# EAGLE design placaSinalizadores (EAGLE 9.6.2)
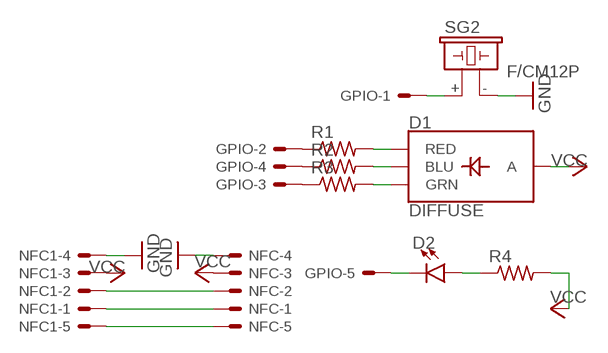
[diagram p0: schematic, sheet 1]

## Parts
D1  DIFFUSE  LED-RGB-CADIFFUSE  [LED-RGB-THRU]
D2  LED5MM  [LED_5MM]
GPIO  JST-XH-05-PIN-LONG-PAD  [JST-XH-05-PACKAGE-LONG-PAD]
NFC  JST-XH-05-PIN-LONG-PAD  [JST-XH-05-PACKAGE-LONG-PAD]
NFC1  JST-XH-05-PIN-LONG-PAD  [JST-XH-05-PACKAGE-LONG-PAD]
R1  R-US_0204/7  [0204/7]
R2  R-US_0204/7  [0204/7]
R3  R-US_0204/7  [0204/7]
R4  R-US_0204/7  [0204/7]
SG2  F/CM12P  [F/CM12P]

## Nets
GND: NFC1.4 NFC.4 SG2.-
N$1: D1.1(RED) R1.2
N$2: D1.4(BLU) R2.2
N$3: D1.3(GRN) R3.2
N$4: D2.A R4.1
N$5: NFC1.2 NFC.2
N$6: NFC1.1 NFC.1
N$7: D2.K(C) GPIO.5
N$8: GPIO.1 SG2.+
N$9: GPIO.2 R1.1
N$10: GPIO.4 R2.1
N$11: GPIO.3 R3.1
N$12: NFC1.5 NFC.5
VCC: D1.2(A) NFC1.3 NFC.3 R4.2

## Library data of the parts
D1 = SparkFun-LED:LED-RGB-CA: LED-RGB Diffused Common Anode Packages: LED RGB-THRU P-LCC-4-3 LED-TRICOLOR-SMD SparkFun Products: RGB Diffused Common Anode- Diffuse <[https://www.sparkfun.com/products/10821]> RGB Diffused Common Anode - Clear <[https://www.sparkfun.com/products/10820]> Qduino Mini <[https://www.sparkfun.com/products/13614]> Triple Output LED RGB - SMD <https://www.sparkfun.com/products/7844>; PROD_ID: DIO-10632
D2 = SparkFun-LED:LED: LED (Generic) Standard schematic elements and footprints for 5mm, 3mm, 1206, and 0603 sized LEDs. Generic LEDs with no color specified.
GPIO NFC NFC1 = jst-xh-ornan:JST-XH-05-PIN: JST XH Connector 2 Pin Wire to board connector. Pitch: 2,54 mm, (0.100") Number of pins: 5 Created by Rembrandt Electronics www.rembrandtelectronics.com
R1-R4 = rcl-ornan:R-US_: RESISTOR, American symbol; SPICEPREFIX: R
SG2 = buzzer:F/CM12P: BUZZER Source: Buerklin; OC_FARNELL: unknown; OC_NEWARK: unknown

## Board
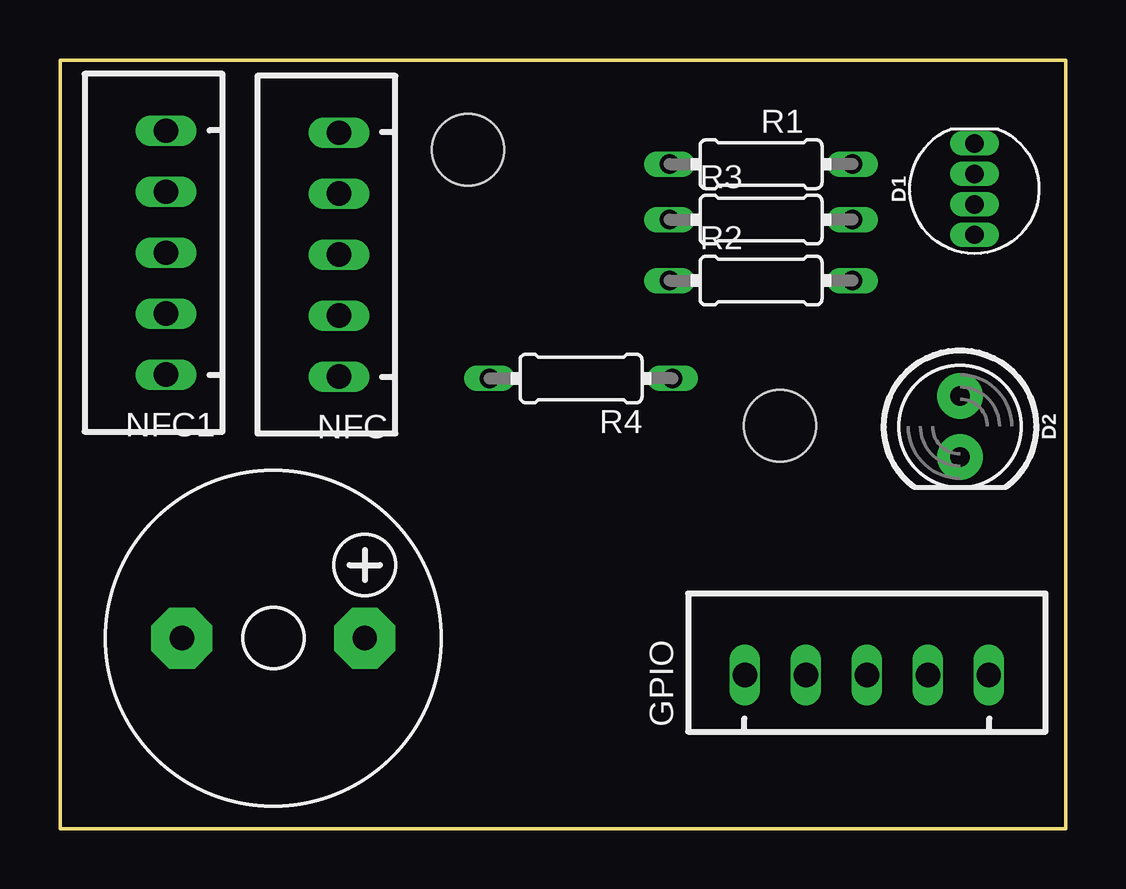
[diagram p1: board, top side]
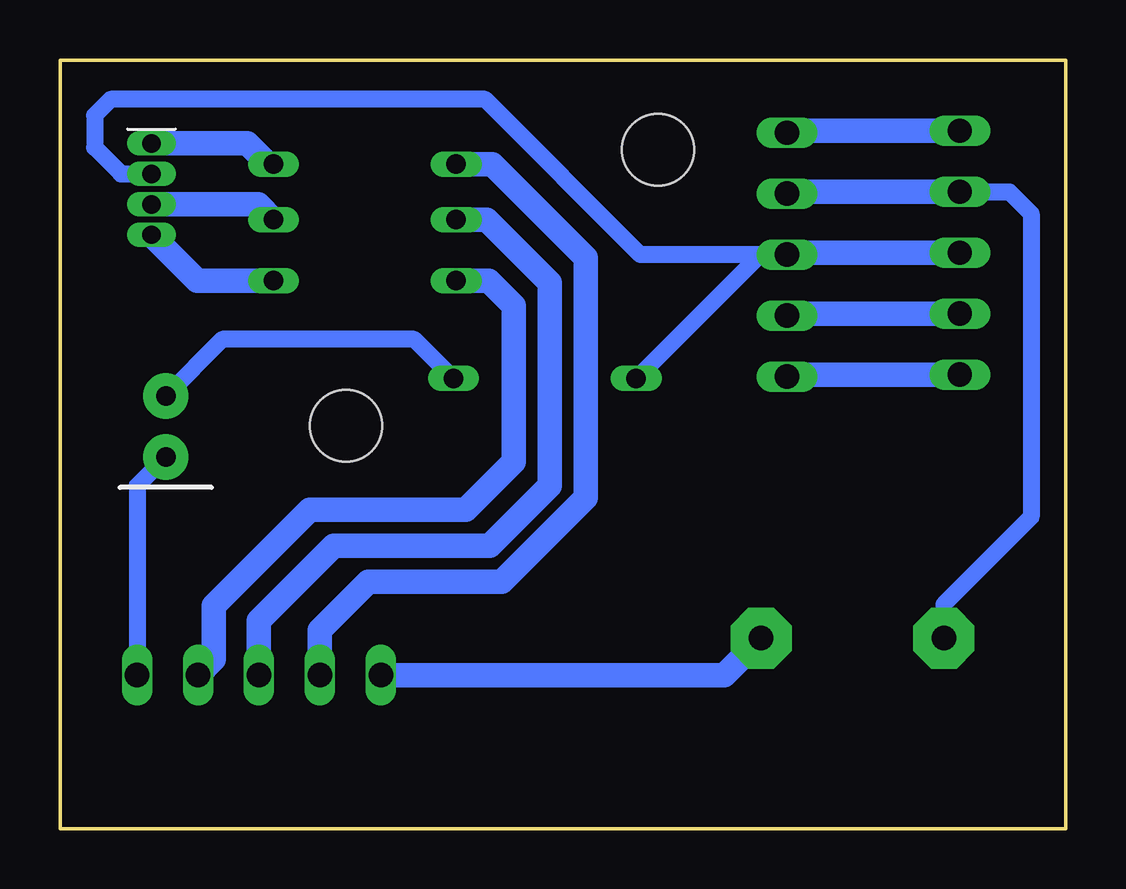
[diagram p2: board, bottom side, seen from below]

Size 41.91 x 32.04 mm. Coordinates in mm from the lower left corner, seen from the top.
Outline: 0,32.04 0,0 41.91,0 41.91,32.04 0,32.04
Copper layers (1*16): Top 0.035mm / dielectric 1.5mm / Bottom 0.035mm
Design rules "default *": minimum track width 6mil, minimum drill 0.35mm, track to track 6mil, track to pad 6mil, pad to pad 6mil, via to via 6mil, smd to smd 6mil, copper to edge 40mil, drill to drill 6mil, minimum pad ring 3mil, minimum via ring 8mil, stop-mask expansion 4mil, vias tented up to drill 0mil, thermal gap 10mil
Holes 3 mm at 30,16.8 17,28.3

### Footprints (pad centres in the part's own frame; a part is rotated, then mirrored left to right if it is on the bottom)
LED-RGB-THRU = drill 0.762 pad 0.889 long: 1 1.905,0; 2 0.635,0; 3 -0.635,0; 4 -1.905,0
LED_5MM = drill 0.813 pad 1.88: A -1.27,0; K 1.27,0
JST-XH-05-PACKAGE-LONG-PAD = drill 1.016 long: 1 -5.08,0; 2 -2.54,0; 3 0,0; 4 2.54,0; 5 5.08,0
0204/7 = drill 0.813 long: 1 -3.81,0; 2 3.81,0
F/CM12P = drill 1.016 pad 2.54 octagon: + 3.81,0; - -3.81,0

### Placement (x,y rotation side)
D1  38.1,26.66 90 top
D2  37.5,16.77 270 top
GPIO  33.62,6.41 0 top
NFC  11.62,23.93 90 top
NFC1  4.42,24.01 90 top
R1  29.21,27.7 0 top
R2  29.21,22.85 0 top
R3  29.21,25.39 0 top
R4  21.71,18.77 180 top
SG2  8.89,7.95 0 top

### Tracks (layer width: path | path; a pad name or v marks a point on that pad's centre or on a via)
GND
  Bottom 0.7: NFC1.4 2.35,26.55 1.44,25.64 1.44,13 5.08,9.36 SG2.-
  Bottom 1.016: NFC.4 11.54,26.55 NFC1.4
N$1
  Bottom 1.016: D1.1 34.1,28.57 33.23,27.7 R1.2
N$2
  Bottom 1.016: D1.4 36.2,22.85 R2.2
N$3
  Bottom 1.016: D1.3 33.66,26.03 R3.2
N$4
  Bottom 0.7: R4.1 27.15,20.4 35.14,20.4 D2.A
N$5
  Bottom 1.016: NFC.2 11.54,21.47 NFC1.2
N$6
  Bottom 1.016: NFC.1 11.54,18.93 NFC1.1
N$7
  Bottom 0.7: D2.K 38.7,14.3 GPIO.5
N$8
  Bottom 1.016: SG2.+ 14.24,6.41 GPIO.1
N$9
  Bottom 1.016: GPIO.2 31.08,8.28 29.06,10.3 23.5,10.3 20,13.8 20,23.8 23.9,27.7 R1.1
N$10
  Bottom 1.016: GPIO.4 35.5,7.07 35.5,9.3 31.5,13.3 25,13.3 23,15.3 23,21.8 24.05,22.85 R2.1
N$11
  Bottom 1.016: R3.1 24.13,25.39 21.5,22.76 21.5,14.3 24,11.8 30.5,11.8 33.62,8.68 GPIO.3 33.62,7.58
N$12
  Bottom 1.016: NFC.5 11.54,29.09 NFC1.5
VCC
  Bottom 0.7: D1.2 39.36,27.3 40.47,28.4 40.47,29.73 39.8,30.4 24.2,30.4 17.73,23.93 NFC.3 12.74,23.93 17.86,18.81
  Bottom 1.016: NFC.3 11.54,24.01 NFC1.3 | 17.86,18.81 R4.2